# EAGLE design kidpcb (EAGLE 5.11)
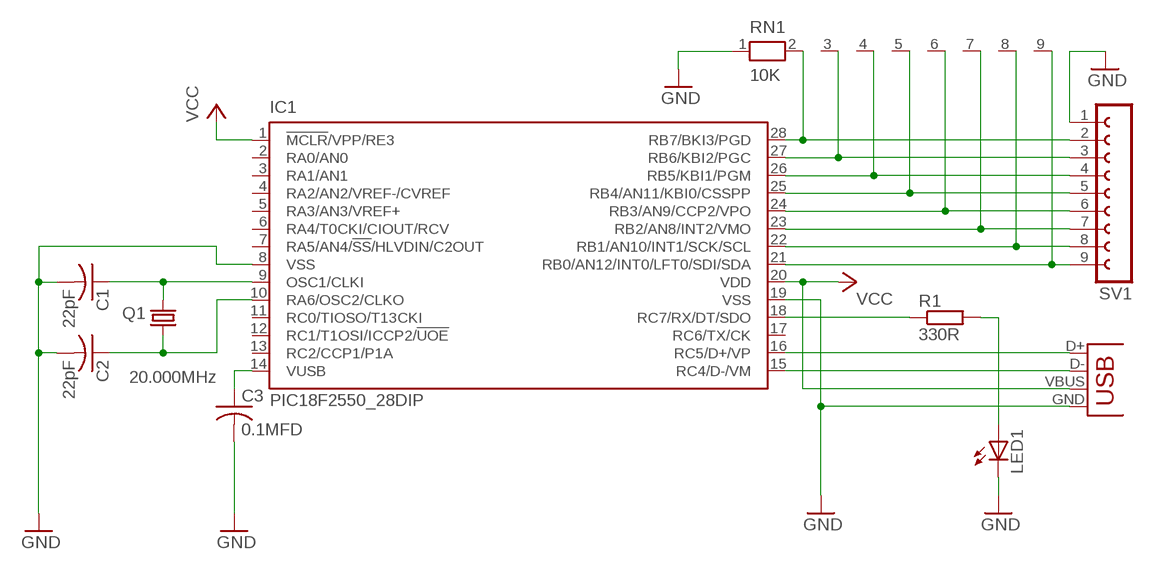
[diagram p0: schematic, sheet 1]

## Parts
C1  22pF  C-US025-030X050  [C025-030X050]
C2  22pF  C-US025-030X050  [C025-030X050]
C3  0.1MFD  C-US025-040X050  [C025-040X050]
IC1  PIC18F2550_28DIP  [DIL28-3]
LED1  LED3MM  [LED3MM]
Q1  20.000MHz  CRYSTALHC49U-V  [HC49U-V]
R1  330R  R-EU_0204/5  [0204/5]
RN1  10K  RN08  [RN-9]
SV1  FE09-1  [FE09]
X1  USBPTH  [USB-B-PTH]

## Nets
GND: C1.2 C2.2 C3.2 IC1.8(VSS) IC1.19(VSS) LED1.K(C) RN1.1 SV1.1 X1.GND
N$1: IC1.16(RC5/D+/VP) X1.D+
N$2: IC1.15(RC4/D-/VM) X1.D-
N$4: C1.1 IC1.9(OSC1/CLKI) Q1.2
N$5: C2.1 IC1.10(RA6/OSC2/CLKO) Q1.1
N$6: C3.1 IC1.14(VUSB)
N$7: IC1.28(RB7/BKI3/PGD) RN1.2 SV1.2
N$8: IC1.27(RB6/KBI2/PGC) RN1.3 SV1.3
N$9: IC1.26(RB5/KBI1/PGM) RN1.4 SV1.4
N$10: IC1.25(RB4/AN11/KBI0/CSSPP) RN1.5 SV1.5
N$11: IC1.24(RB3/AN9/CCP2/VPO) RN1.6 SV1.6
N$12: IC1.23(RB2/AN8/INT2/VMO) RN1.7 SV1.7
N$13: IC1.22(RB1/AN10/INT1/SCK/SCL) RN1.8 SV1.8
N$14: IC1.21(RB0/AN12/INT0/LFT0/SDI/SDA) RN1.9 SV1.9
N$15: IC1.18(RC7/RX/DT/SDO) R1.1
N$16: LED1.A R1.2
VCC: IC1.1(!MCLR!/VPP/RE3) IC1.20(VDD) X1.VBUS
Unconnected: IC1.2(RA0/AN0) IC1.3(RA1/AN1) IC1.4(RA2/AN2/VREF-/CVREF) IC1.5(RA3/AN3/VREF+) IC1.6(RA4/T0CKI/CIOUT/RCV) IC1.7(RA5/AN4/!SS!/HLVDIN/C2OUT) IC1.11(RC0/TIOSO/T13CKI) IC1.12(RC1/T1OSI/ICCP2/!UOE) IC1.13(RC2/CCP1/P1A) IC1.17(RC6/TX/CK)

## Library data of the parts
C1-C3 = rcl:C-US: CAPACITOR, American symbol
IC1 = microchip:PIC18F2*_28: USB Microcontrollers with nanoWatt Technology High-Performance, Enhanced Flash, 28/40/44-Pin, Source: http://ww1.microchip.com/downloads/en/devicedoc/39632c.pdf; MF: MICROCHIP; MPN: PIC18F2550-I/SP; OC_FARNELL: 1523822; OC_NEWARK: 80K6054
LED1 = led:LED: LED OSRAM: - CHIPLED LG R971, LG N971, LY N971, LG Q971, LY Q971, LO R971, LY R971 LH N974, LH R974 LS Q976, LO Q976, LY Q976 LO Q996 - Hyper CHIPLED LW Q18S LB Q993, LB Q99A, LB R99A - SideLED LS A670, LO A670, LY A670, LG A670, LP A670 LB A673, LV A673, LT A673, LW A673 LH A674 LY A675 LS A676, LA A676, LO A676, LY A676, LW A676 LS A679, LY A679, LG A679 - Hyper Micro SIDELED® LS Y876, LA Y876, LO Y876, LY Y876 LT Y87S - SmartLED LW L88C, LW L88S LB L89C, LB L89S, LG L890 LS L89K, LO L89K, LY L89K LS L896, LA L896, LO L896, LY L896 - TOPLED LS T670, LO T670, LY T670, LG T670, LP T670 LSG T670, LSP T670, LSY T670, LOP T670, LYG T670 LG T671, LOG T671, LSG T671 LB T673, LV T673, LT T673, LW T673 LH T674 LS T676, LA T676, LO T676, LY T676, LB T676, LH T676, LSB T676, LW T676 LB T67C, LV T67C, LT T67C, LS T67K, LO T67K, LY T67K, LW E67C LS E67B, LA E67B, LO E67B, LY E67B, LB E67C, LV E67C, LT E67C LW T67C LS T679, LY T679, LG T679 LS T770, LO T770, LY T770, LG T770, LP T770 LB T773, LV T773, LT T773, LW T773 LH T774 LS E675, LA E675, LY E675, LS T675 LS T776, LA T776, LO T776, LY T776, LB T776 LHGB T686 LT T68C, LB T68C - Hyper Mini TOPLED® LB M676 - Mini TOPLED Santana® LG M470 LS M47K, LO M47K, LY M47K Source: http://www.osram.convergy.de LUXEON: - LUMILED® LXK2-PW12-R00, LXK2-PW12-S00, LXK2-PW14-U00, LXK2-PW14-V00 LXK2-PM12-R00, LXK2-PM12-S00, LXK2-PM14-U00 LXK2-PE12-Q00, LXK2-PE12-R00, LXK2-PE12-S00, LXK2-PE14-T00, LXK2-PE14-U00 LXK2-PB12-K00, LXK2-PB12-L00, LXK2-PB12-M00, LXK2-PB14-N00, LXK2-PB14-P00, LXK2-PB14-Q00 LXK2-PR12-L00, LXK2-PR12-M00, LXK2-PR14-Q00, LXK2-PR14-R00 LXK2-PD12-Q00, LXK2-PD12-R00, LXK2-PD12-S00 LXK2-PH12-R00, LXK2-PH12-S00 LXK2-PL12-P00, LXK2-PL12-Q00, LXK2-PL12-R00 Source: www.luxeon.com KINGBRIGHT: KA-3528ASYC Source: www.kingbright.com
Q1 = crystal:CRYSTAL: CRYSTAL; OC_FARNELL: 1666969; OC_NEWARK: unknown
R1 = rcl:R-EU_: RESISTOR, European symbol
RN1 = resistor-net:RN08: RESISTOR NETWORK; OC_FARNELL: unknown; OC_NEWARK: unknown
SV1 = con-lsta:FE09-1: FEMALE HEADER; OC_FARNELL: unknown; OC_NEWARK: unknown
X1 = SparkFun:USB: USB Connectors USB-B-PTH is fully proven SKU : PRT-00139 USB-miniB is fully proven SKU : PRT-00587 USB-A-PCB is untested. USB-A-H is throughly reviewed, but untested. Spark Fun Electronics SKU : PRT-00437 USB-B-SMT is throughly reviewed, but untested. Needs silkscreen touching up. USB-A-S has not been used/tested USB-MB-H has not been used/tested

## Board
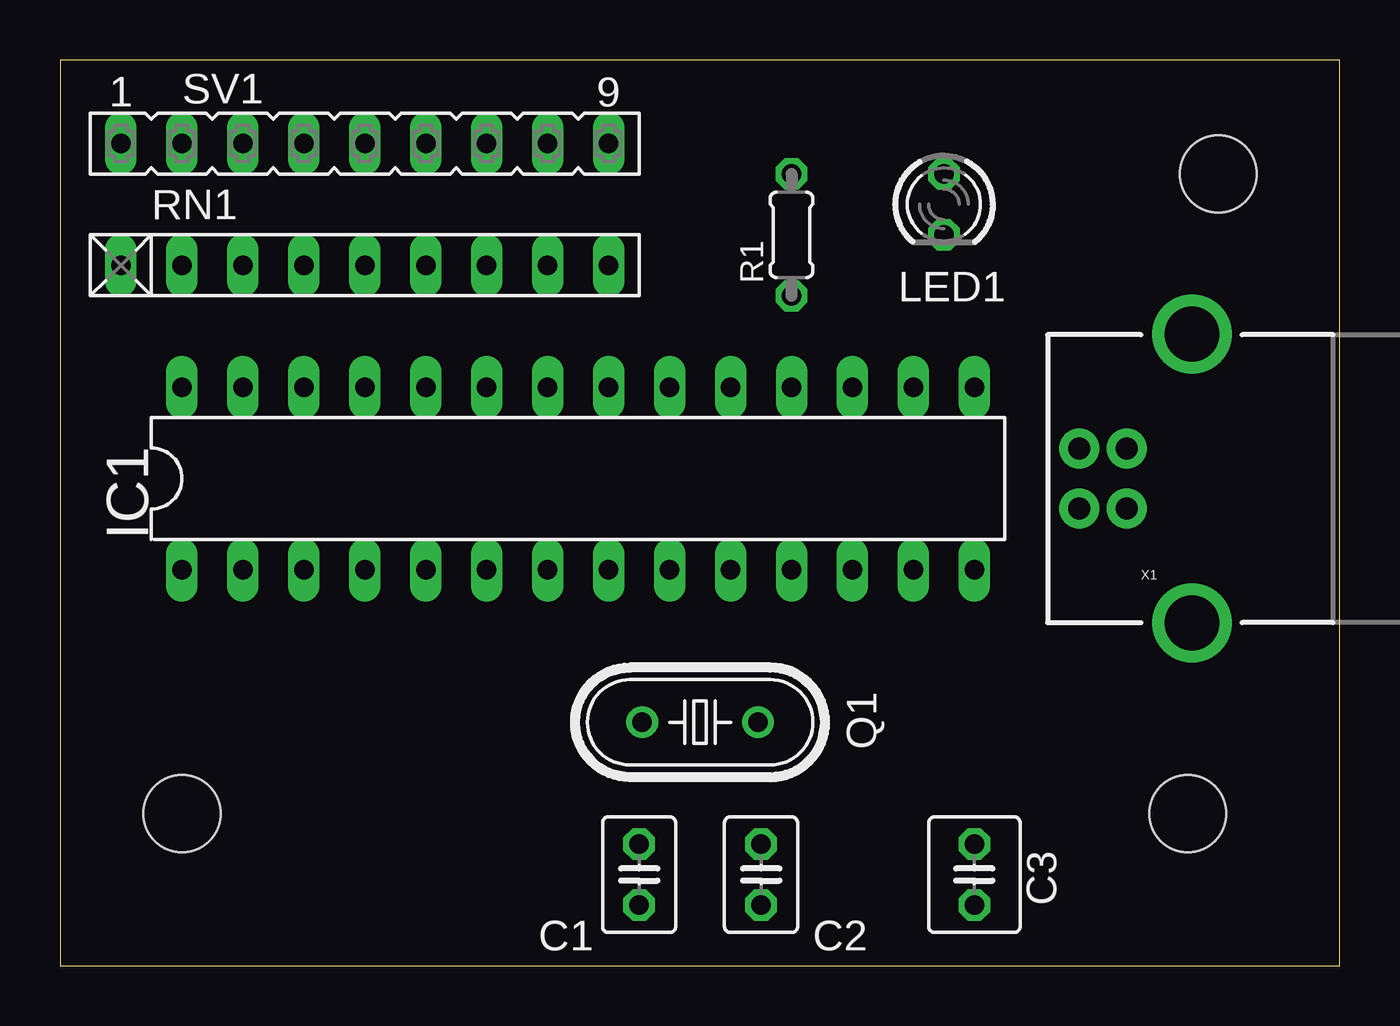
[diagram p1: board, top side]
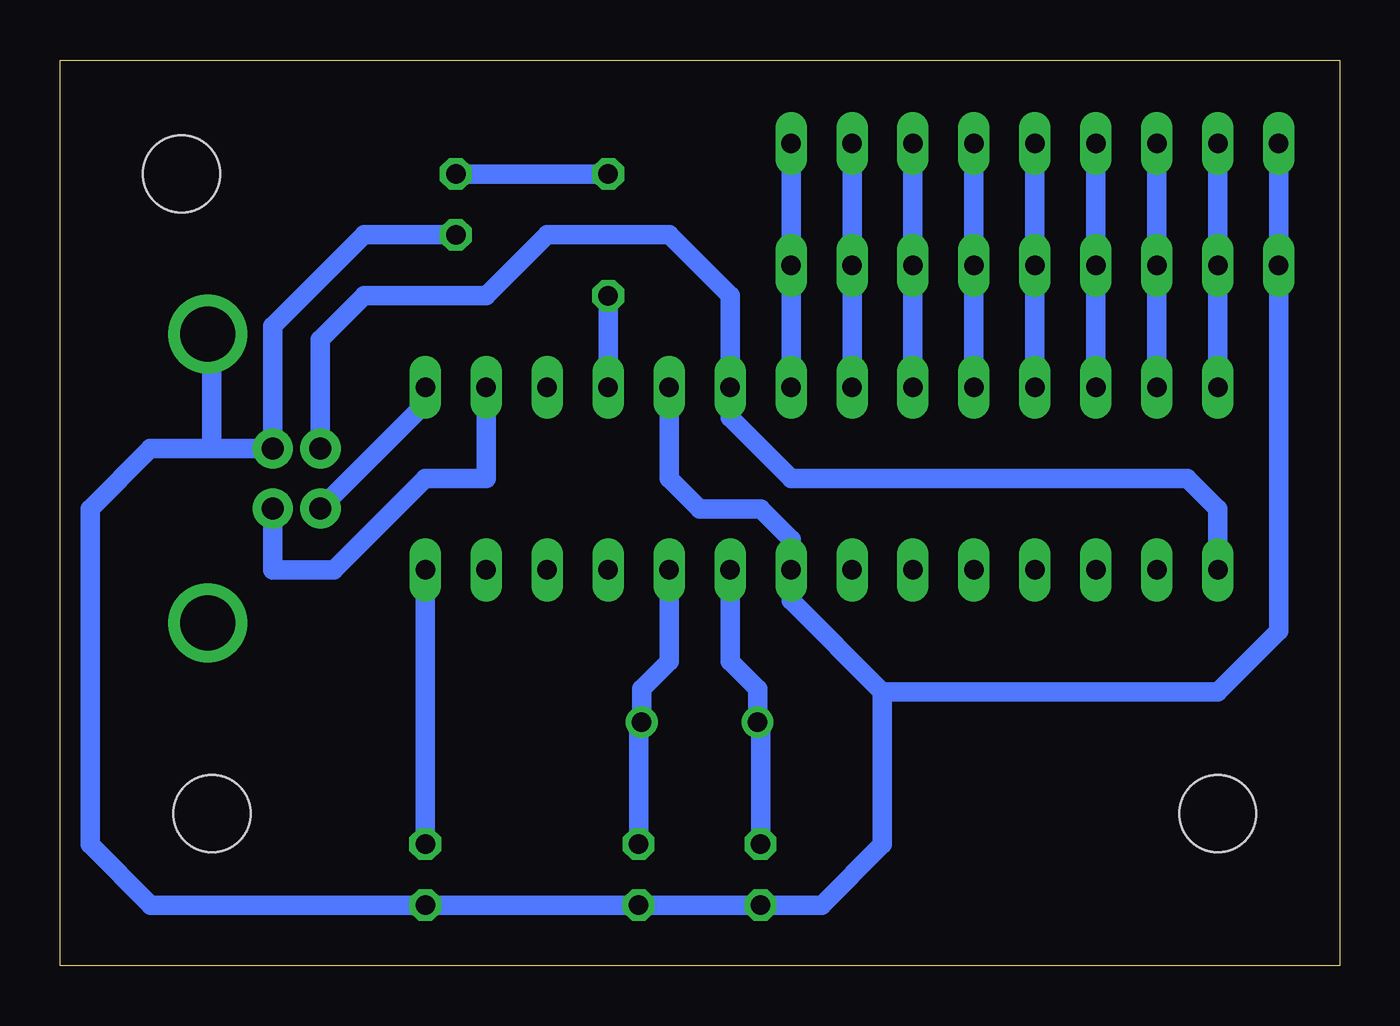
[diagram p2: board, bottom side, seen from below]

Size 53.32 x 37.77 mm. Coordinates in mm from the lower left corner, seen from the top.
Outline: 0,0 53.32,0 53.32,37.77 0,37.77 0,0
Copper layers (1*16): Top 0.035mm / dielectric 1.5mm / Bottom 0.035mm
Design rules "default": minimum track width 10mil, minimum drill 24mil, track to track 8mil, track to pad 8mil, pad to pad 8mil, via to via 8mil, smd to smd 8mil, copper to edge 40mil, drill to drill 8mil, minimum pad ring 10mil, minimum via ring 8mil, stop-mask expansion 4mil, vias tented up to drill 0mil, thermal gap 10mil
Holes 3.2 mm at 5.08,6.35 48.26,33.02 46.99,6.35

### Footprints (pad centres in the part's own frame; a part is rotated, then mirrored left to right if it is on the bottom)
C025-030X050 = drill 0.813 octagon: 1 -1.27,0; 2 1.27,0
C025-040X050 = drill 0.813 octagon: 1 -1.27,0; 2 1.27,0
DIL28-3 = drill 0.813 long: 1 -16.51,-3.81; 2 -13.97,-3.81; 3 -11.43,-3.81; 4 -8.89,-3.81; 5 -6.35,-3.81; 6 -3.81,-3.81; 7 -1.27,-3.81; 8 1.27,-3.81; 9 3.81,-3.81; 10 6.35,-3.81; 11 8.89,-3.81; 12 11.43,-3.81; 13 13.97,-3.81; 14 16.51,-3.81; 15 16.51,3.81; 16 13.97,3.81; 17 11.43,3.81; 18 8.89,3.81; 19 6.35,3.81; 20 3.81,3.81; 21 1.27,3.81; 22 -1.27,3.81; 23 -3.81,3.81; 24 -6.35,3.81; 25 -8.89,3.81; 26 -11.43,3.81; 27 -13.97,3.81; 28 -16.51,3.81
LED3MM = drill 0.813 octagon: A -1.27,0; K 1.27,0
HC49U-V = drill 0.813 round: 1 -2.413,0; 2 2.413,0
0204/5 = drill 0.813 octagon: 1 -2.54,0; 2 2.54,0
RN-9 = drill 0.813 long: 1 -10.16,0; 2 -7.62,0; 3 -5.08,0; 4 -2.54,0; 5 0,0; 6 2.54,0; 7 5.08,0; 8 7.62,0; 9 10.16,0
FE09 = drill 0.813 long: 1 -10.16,0; 2 -7.62,0; 3 -5.08,0; 4 -2.54,0; 5 0,0; 6 2.54,0; 7 5.08,0; 8 7.62,0; 9 10.16,0
USB-B-PTH = drill 0.914 pad 1.676 round: D+ 0,1.25; D- 1.981,1.25; GND 0,-1.25; VBUS 1.981,-1.25 | drill 2.286 round: S1 -2.718,-6.02; S2 -2.718,6.02

### Placement (x,y rotation side)
C1  24.13,3.81 270 top
C2  29.21,3.81 270 top
C3  38.1,3.81 270 top
IC1  21.59,20.32 0 top
LED1  36.83,31.75 270 top
Q1  26.67,10.16 180 top
R1  30.48,30.48 90 top
RN1  12.7,29.21 0 top
SV1  12.7,34.29 0 top
X1  44.45,20.32 180 top

### Tracks (layer width: path | path; a pad name or v marks a point on that pad's centre or on a via)
GND
  Bottom 0.813: LED1.K 40.64,30.48 44.45,26.67 X1.GND 49.55,21.57 52.07,19.05 52.07,5.08 49.53,2.54 C3.2 C2.2 C1.2 21.59,2.54 19.05,5.08 19.05,11.43 | IC1.19 27.94,20.32 26.67,19.05 24.13,19.05 22.86,17.78 IC1.8 22.86,15.24 19.05,11.43 | 19.05,11.43 5.08,11.43 2.54,13.97 RN1.1 SV1.1
N$1
  Bottom 0.813: X1.D+ 44.45,16.51 41.91,16.51 38.1,20.32 35.56,20.32 IC1.16
N$2
  Bottom 0.813: IC1.15 38.1,23.44 X1.D-
N$3
  Bottom 0.813: 46.99,21.59 46.99,24.77
N$4
  Bottom 0.813: C1.1 24.13,10.03 Q1.2 24.26,11.56 25.4,12.7 IC1.9
N$5
  Bottom 0.813: C2.1 29.21,10.03 Q1.1 29.08,11.56 27.94,12.7 IC1.10
N$6
  Bottom 0.813: C3.1 IC1.14
N$7
  Bottom 0.813: IC1.28 RN1.2 SV1.2
N$8
  Bottom 0.813: IC1.27 RN1.3 SV1.3
N$9
  Bottom 0.813: IC1.26 RN1.4 SV1.4
N$10
  Bottom 0.813: IC1.25 RN1.5 SV1.5
N$11
  Bottom 0.813: IC1.24 RN1.6 SV1.6
N$12
  Bottom 0.813: IC1.23 RN1.7 SV1.7
N$13
  Bottom 0.813: IC1.22 RN1.8 SV1.8
N$14
  Bottom 0.813: IC1.21 RN1.9 SV1.9
N$15
  Bottom 0.813: IC1.18 R1.1
N$16
  Bottom 0.813: R1.2 LED1.A
VCC
  Bottom 0.813: X1.VBUS 42.47,26.11 40.64,27.94 35.56,27.94 33.02,30.48 27.94,30.48 25.4,27.94 IC1.20 25.4,22.86 22.86,20.32 6.35,20.32 5.08,19.05 IC1.1